# Altium schematic sheet 04-ANDStatusLed.SchDoc
size A4; DocumentNumber: 4; SheetNumber: 4; SheetTotal: 26
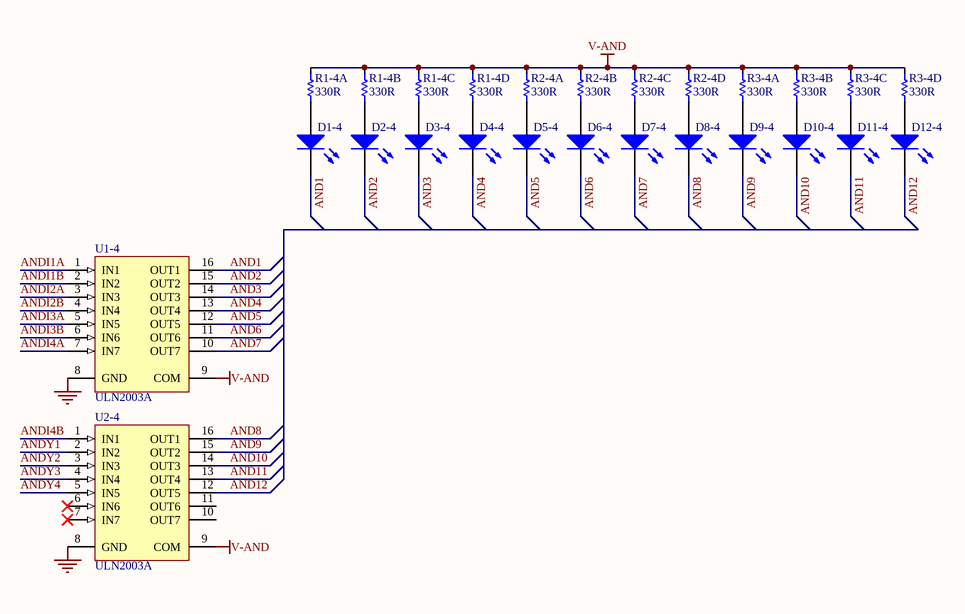
[diagram p0: 04-ANDStatusLed.SchDoc]

## Parts
D1-4  LED  [LED-0805]  (value not drawn)
D2-4  LED  [LED-0805]  (value not drawn)
D3-4  LED  [LED-0805]  (value not drawn)
D4-4  LED  [LED-0805]  (value not drawn)
D5-4  LED  [LED-0805]  (value not drawn)
D6-4  LED  [LED-0805]  (value not drawn)
D7-4  LED  [LED-0805]  (value not drawn)
D8-4  LED  [LED-0805]  (value not drawn)
D9-4  LED  [LED-0805]  (value not drawn)
D10-4  LED  [LED-0805]  (value not drawn)
D11-4  LED  [LED-0805]  (value not drawn)
D12-4  LED  [LED-0805]  (value not drawn)
R1-4  330R  [R-Array-0603-4]  (parts A,B,C,D of 4)
R2-4  330R  [R-Array-0603-4]  (parts A,B,C,D of 4)
R3-4  330R  [R-Array-0603-4]  (parts A,B,C,D of 4)
U1-4  ULN2003A  [SOIC-16]
U2-4  ULN2003A  [SOIC-16]

## Nets
GND: U1-4.8(GND) U2-4.8(GND)
V-AND: R1-4.2 R1-4.4 R1-4.6 R1-4.8 R2-4.2 R2-4.4 R2-4.6 R2-4.8 R3-4.2 R3-4.4 R3-4.6 R3-4.8 U1-4.9(COM) U2-4.9(COM)
AND1: D1-4.2(K) U1-4.16(OUT1)
AND2: D2-4.2(K) U1-4.15(OUT2)
AND3: D3-4.2(K) U1-4.14(OUT3)
AND4: D4-4.2(K) U1-4.13(OUT4)
AND5: D5-4.2(K) U1-4.12(OUT5)
AND6: D6-4.2(K) U1-4.11(OUT6)
AND7: D7-4.2(K) U1-4.10(OUT7)
AND8: D8-4.2(K) U2-4.16(OUT1)
AND9: D9-4.2(K) U2-4.15(OUT2)
AND10: D10-4.2(K) U2-4.14(OUT3)
AND11: D11-4.2(K) U2-4.13(OUT4)
AND12: D12-4.2(K) U2-4.12(OUT5)
ANDI1A: U1-4.1(IN1)
ANDI1B: U1-4.2(IN2)
ANDI2A: U1-4.3(IN3)
ANDI2B: U1-4.4(IN4)
ANDI3A: U1-4.5(IN5)
ANDI3B: U1-4.6(IN6)
ANDI4A: U1-4.7(IN7)
ANDI4B: U2-4.1(IN1)
ANDY1: U2-4.2(IN2)
ANDY2: U2-4.3(IN3)
ANDY3: U2-4.4(IN4)
ANDY4: U2-4.5(IN5)
NetD1-4_1: D1-4.1(A) R1-4.1
NetD2-4_1: D2-4.1(A) R1-4.3
NetD3-4_1: D3-4.1(A) R1-4.5
NetD4-4_1: D4-4.1(A) R1-4.7
NetD5-4_1: D5-4.1(A) R2-4.1
NetD6-4_1: D6-4.1(A) R2-4.3
NetD7-4_1: D7-4.1(A) R2-4.5
NetD8-4_1: D8-4.1(A) R2-4.7
NetD9-4_1: D9-4.1(A) R3-4.1
NetD10-4_1: D10-4.1(A) R3-4.3
NetD11-4_1: D11-4.1(A) R3-4.5
NetD12-4_1: D12-4.1(A) R3-4.7

Not connected (* = marked no-connect by the designer): U2-4 6(IN6)* 7(IN7)* 10(OUT7) 11(OUT6)

## Library data of the parts
D1-4 D2-4 D3-4 D4-4 D5-4 D6-4 D7-4 D8-4 D9-4 D10-4 D11-4 D12-4 = LED2: Typical RED, GREEN, YELLOW, AMBER GaAs LED; Published: 8-Jun-2000; LatestRevisionDate: 17-Jul-2002; LatestRevisionNote: Re-released for DXP Platform.; PackageVersion: Feb-2002; PackageReference: 3.2X1.6X1.1; Publisher: Altium Limited; PackageDescription: SM LED; 2 Flat Leads
R1-4 R2-4 R3-4 = Res Array 4: RES ARRAY 4 RES 330 OHM 1206; Manufacturer: Panasonic Electronic Components; Manufacturer Part Number: EXB-38V331JV; Digi-Key Part Number: Y9331TR-ND; Link: http://www.digikey.com/product-detail/en/EXB-38V331JV/Y9331TR-ND/256525
U1-4 U2-4 = ULN2003A: High-Voltage, High-Current Darlington Array; Published: 13-Oct-2000; LatestRevisionDate: 06-Jun-2005; LatestRevisionNote: Stylized 3D Model Added.; DatasheetVersion: 1998; PackageVersion: 1998; PackageReference: A16; Publisher: Altium Limited; PackageDescription: DIP; 16 Leads; Row Spacing 7.62 mm; Pitch 2.54 mm; Code_JEDEC: MS-001-BB; ComponentLink1Description: Manufacturer Link; ComponentLink1URL: http://www.allegromicro.com/